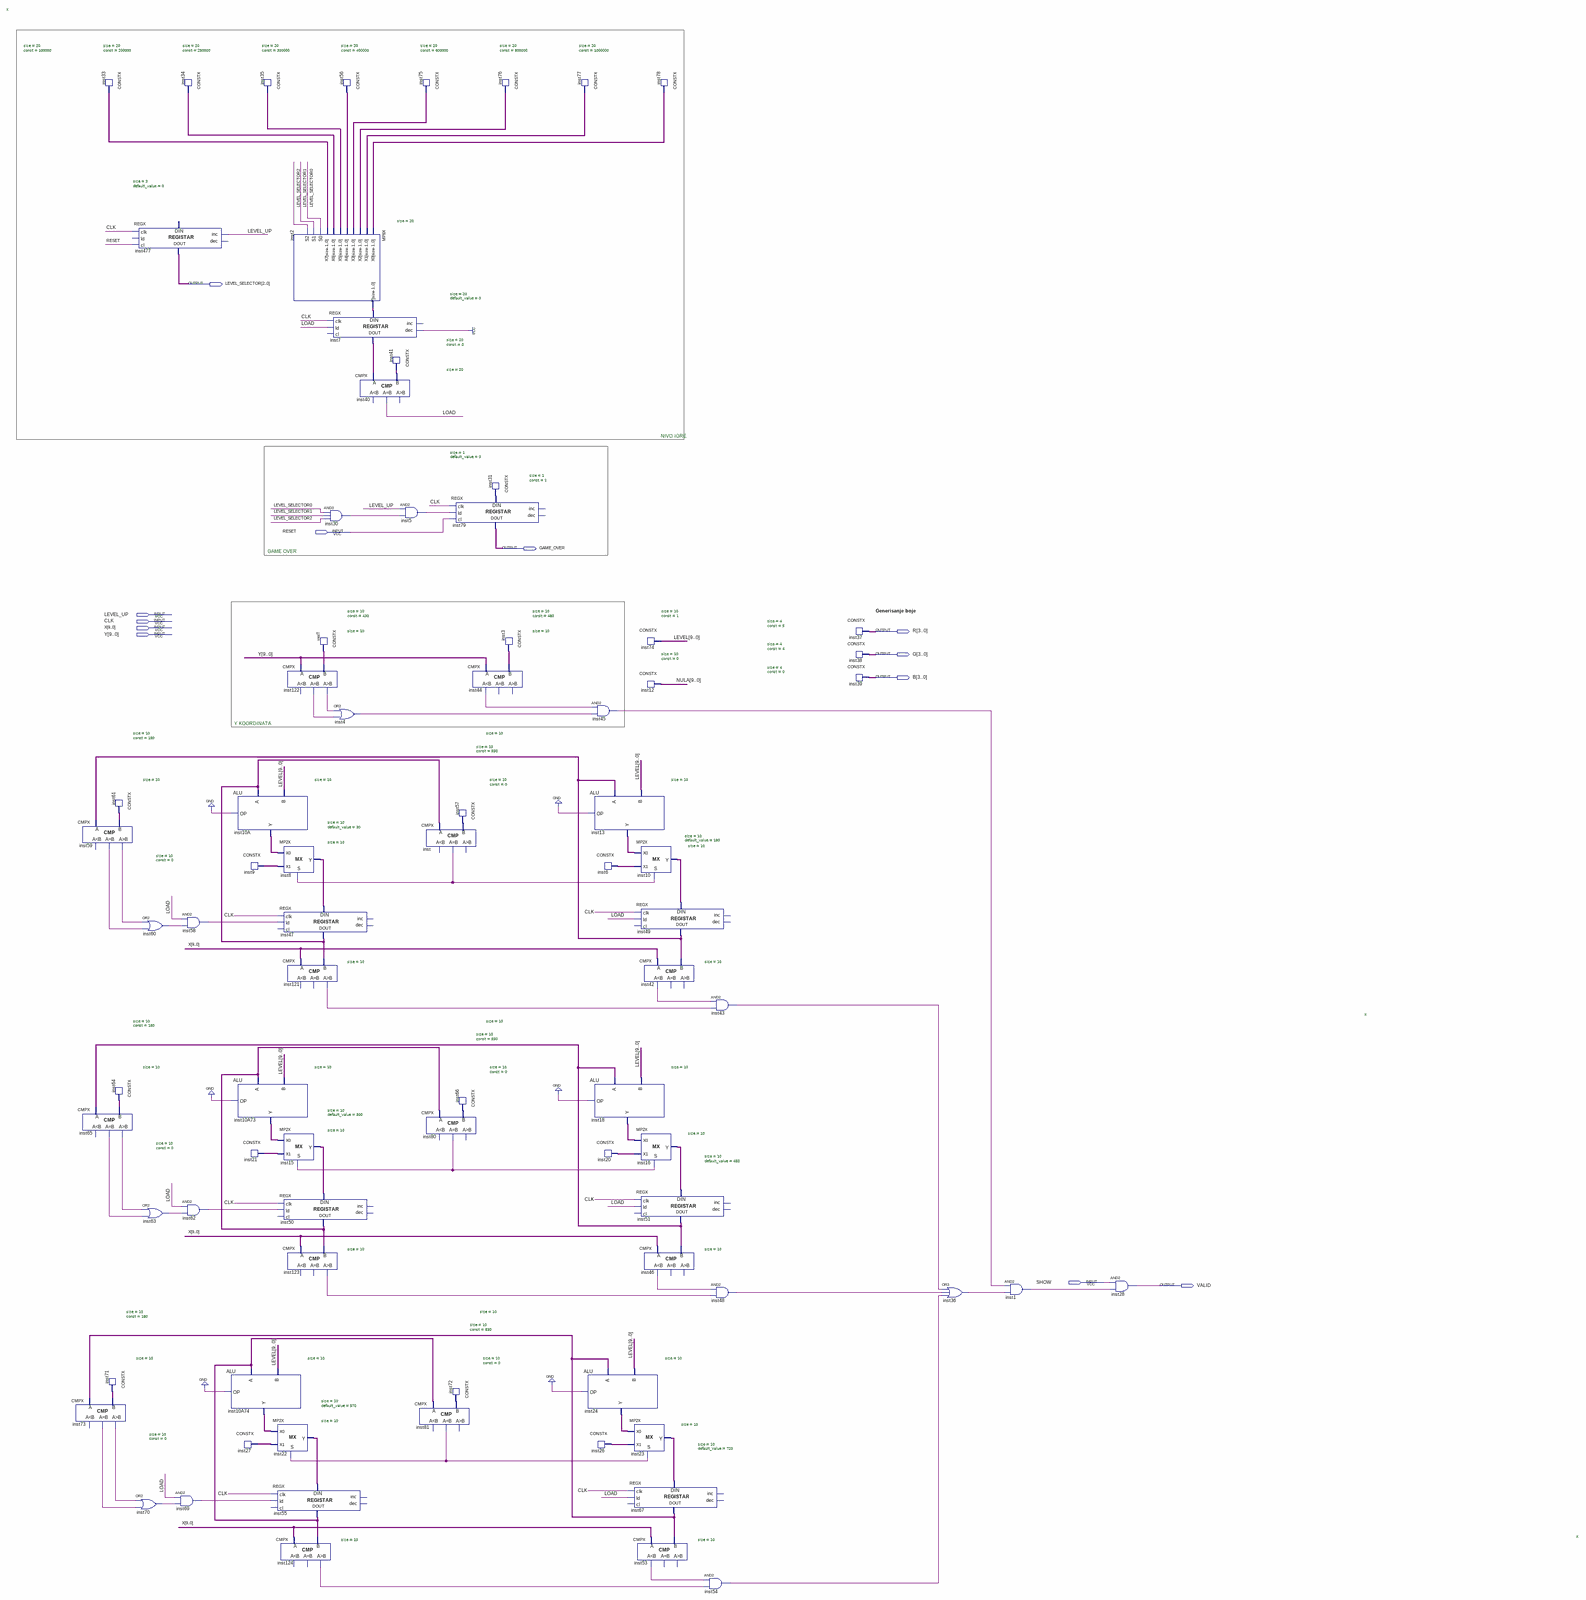
[diagram p0: schematic sheet, whole]
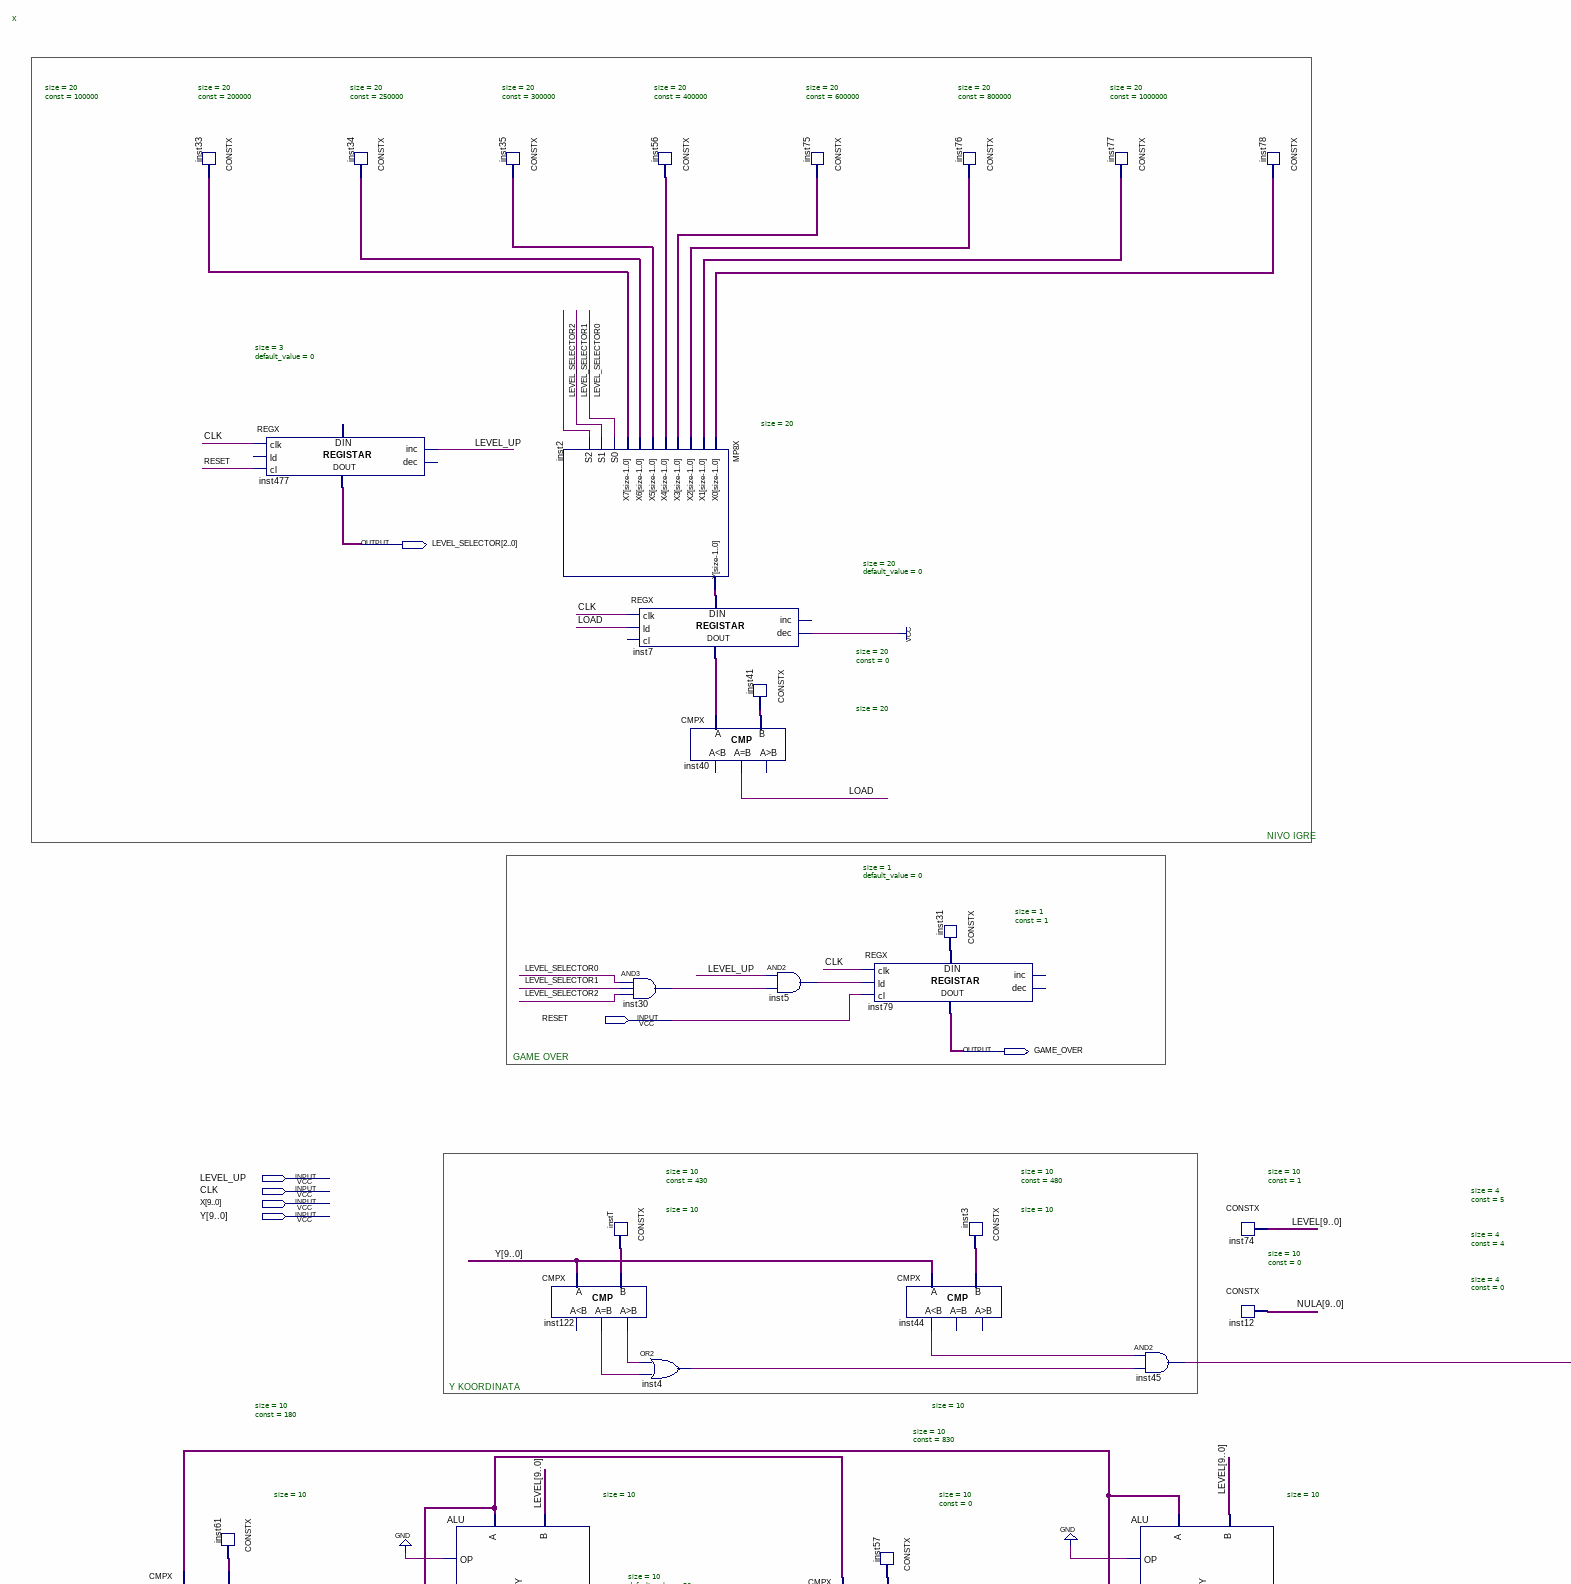
[diagram p1: schematic sheet, upper left part]
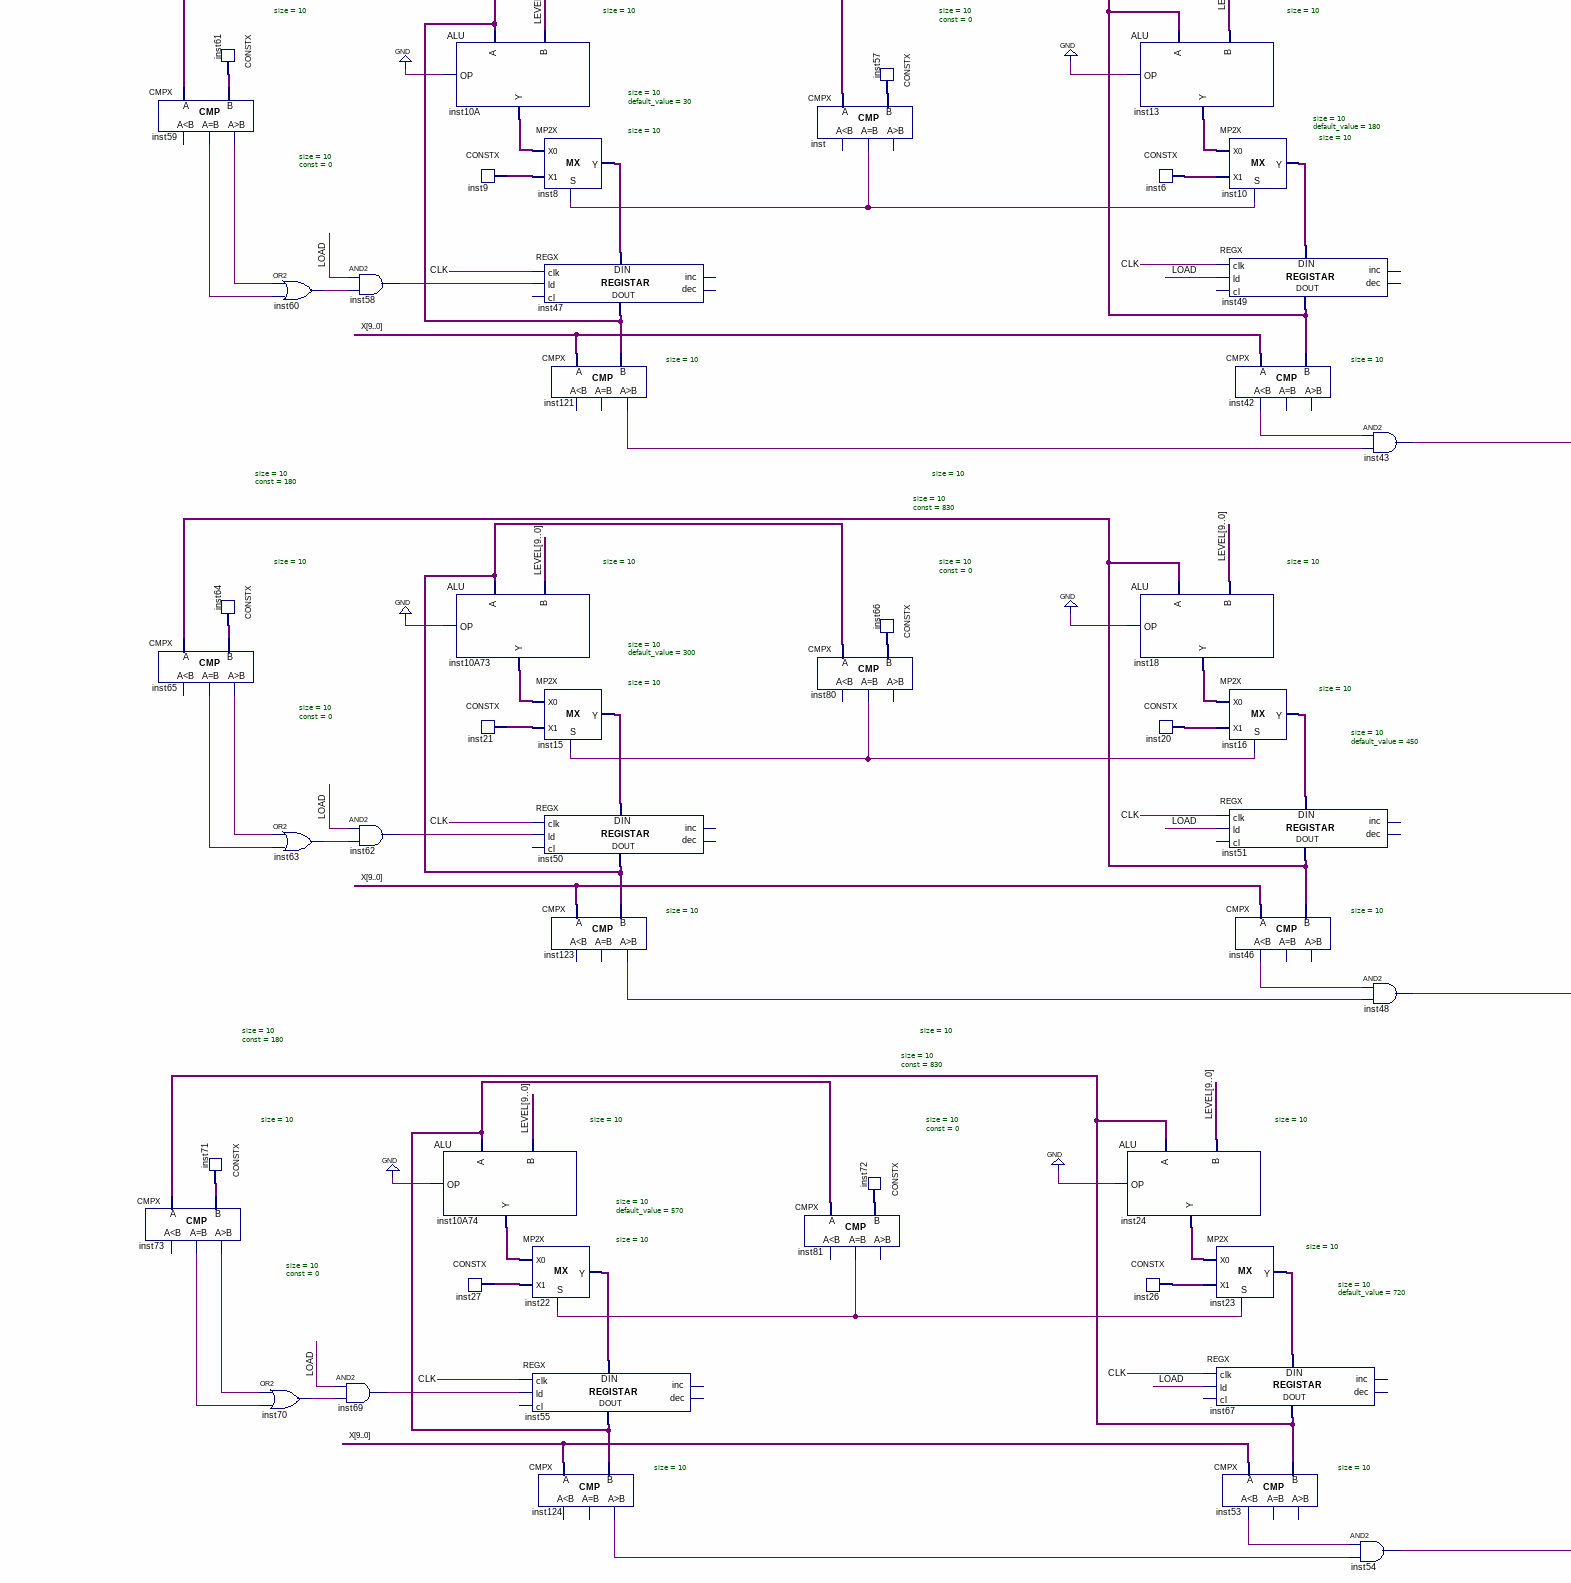
[diagram p2: schematic sheet, lower left part]
// Quartus schematic Layer_Road_3.bdf as structural Verilog: 82 symbols, 12 pins
module Layer_Road_3 (
  input  RESET,
  input  LEVEL_UP,
  input  CLK,
  input  [9:0] X,
  input  [9:0] Y,
  input  SHOW,
  output [2:0] LEVEL_SELECTOR,
  output GAME_OVER,
  output [3:0] R,
  output [3:0] G,
  output [3:0] B,
  output VALID
);

  wire inst1_out, inst4_out, inst5_out, inst30_out, inst31_data, inst36_out, inst42_ls, inst43_out,
       inst44_ls, inst45_out, inst46_ls, inst48_out, inst53_ls, inst54_out, inst58_out, inst59_eq, inst59_gr,
       inst60_out, inst62_out, inst63_out, inst65_eq, inst65_gr, inst69_out, inst70_out, inst73_eq,
       inst73_gr, inst80_eq, inst81_eq, inst121_gr, inst122_eq, inst122_gr, inst123_gr, inst124_gr, inst_eq,
       LOAD;
  wire [9:0] inst3_data, inst6_data, inst8_y, inst9_data, inst10_y, inst10A73_result, inst10A74_result,
       inst10A_result, inst13_result, inst15_y, inst16_y, inst18_result, inst20_data, inst21_data, inst22_y,
       inst23_y, inst24_result, inst26_data, inst27_data, inst47_data_out, inst49_data_out, inst50_data_out,
       inst51_data_out, inst55_data_out, inst57_data, inst61_data, inst64_data, inst66_data, inst67_data_out,
       inst71_data, inst72_data, instT_data, LEVEL, NULA;
  wire [19:0] inst2_y, inst7_data_out, inst33_data, inst34_data, inst35_data, inst41_data, inst56_data,
       inst75_data, inst76_data, inst77_data, inst78_data;

  CMPX #(.size(10)) inst73 (.A(inst67_data_out), .B(inst71_data), .eq(inst73_eq), .gr(inst73_gr));  // open: ls
  CMPX #(.size(10)) inst59 (.A(inst49_data_out), .B(inst61_data), .eq(inst59_eq), .gr(inst59_gr));  // open: ls
  CMPX #(.size(10)) inst65 (.A(inst51_data_out), .B(inst64_data), .eq(inst65_eq), .gr(inst65_gr));  // open: ls
  CONSTX #(.size(20), .\const (100000)) inst33 (.data(inst33_data));
  CONSTX #(.size(10), .\const (180)) inst61 (.data(inst61_data));
  CONSTX #(.size(10), .\const (180)) inst64 (.data(inst64_data));
  CONSTX #(.size(10), .\const (180)) inst71 (.data(inst71_data));
  REGX #(.size(3), .default_value(0)) inst477 (
    .clk(CLK), .cl(RESET), .inc(LEVEL_UP), .data_out(LEVEL_SELECTOR));  // open: ld, dec, data_in
  or inst60 (inst60_out, inst59_gr, inst59_eq);
  or inst63 (inst63_out, inst65_gr, inst65_eq);
  or inst70 (inst70_out, inst73_gr, inst73_eq);
  and inst69 (inst69_out, LOAD, inst70_out);
  CONSTX #(.size(20), .\const (200000)) inst34 (.data(inst34_data));
  and inst58 (inst58_out, LOAD, inst60_out);
  and inst62 (inst62_out, LOAD, inst63_out);
  ALU #(.size(10)) inst10A74 (.op(1'b0), .a(inst55_data_out), .b(LEVEL), .result(inst10A74_result));
  ALU #(.size(10)) inst10A (.op(1'b0), .a(inst47_data_out), .b(LEVEL), .result(inst10A_result));
  CONSTX #(.size(10), .\const (0)) inst9 (.data(inst9_data));
  ALU #(.size(10)) inst10A73 (.op(1'b0), .a(inst50_data_out), .b(LEVEL), .result(inst10A73_result));
  CONSTX #(.size(10), .\const (0)) inst21 (.data(inst21_data));
  CONSTX #(.size(10), .\const (0)) inst27 (.data(inst27_data));
  CONSTX #(.size(20), .\const (250000)) inst35 (.data(inst35_data));
  CMPX #(.size(10)) inst122 (.A(Y), .B(instT_data), .eq(inst122_eq), .gr(inst122_gr));  // open: ls
  MP2X #(.size(10)) inst8 (.S(inst_eq), .X0(inst10A_result), .X1(inst9_data), .Y(inst8_y));
  REGX #(.size(10), .default_value(30)) inst47 (
    .clk(CLK), .ld(inst58_out), .data_in(inst8_y), .data_out(inst47_data_out));  // open: cl, inc, dec
  CMPX #(.size(10)) inst121 (.A(X), .B(inst47_data_out), .gr(inst121_gr));  // open: ls, eq
  MP2X #(.size(10)) inst15 (.S(inst80_eq), .X0(inst10A73_result), .X1(inst21_data), .Y(inst15_y));
  REGX #(.size(10), .default_value(300)) inst50 (
    .clk(CLK), .ld(inst62_out), .data_in(inst15_y), .data_out(inst50_data_out));  // open: cl, inc, dec
  CMPX #(.size(10)) inst123 (.A(X), .B(inst50_data_out), .gr(inst123_gr));  // open: ls, eq
  MP2X #(.size(10)) inst22 (.S(inst81_eq), .X0(inst10A74_result), .X1(inst27_data), .Y(inst22_y));
  REGX #(.size(10), .default_value(570)) inst55 (
    .clk(CLK), .ld(inst69_out), .data_in(inst22_y), .data_out(inst55_data_out));  // open: cl, inc, dec
  CMPX #(.size(10)) inst124 (.A(X), .B(inst55_data_out), .gr(inst124_gr));  // open: ls, eq
  MP8X #(.size(20)) inst2 (
    .X0(inst78_data), .X1(inst77_data), .X2(inst76_data), .X3(inst75_data), .X4(inst56_data),
    .X5(inst35_data), .X6(inst34_data), .X7(inst33_data), .S0(LEVEL_SELECTOR[0]), .S1(LEVEL_SELECTOR[1]),
    .S2(LEVEL_SELECTOR[2]), .Y(inst2_y));
  REGX #(.size(20), .default_value(0)) inst7 (
    .clk(CLK), .ld(LOAD), .dec(1'b1), .data_in(inst2_y), .data_out(inst7_data_out));  // open: cl, inc
  and inst30 (inst30_out, LEVEL_SELECTOR[0], LEVEL_SELECTOR[1], LEVEL_SELECTOR[2]);
  CONSTX #(.size(10), .\const (430)) instT (.data(instT_data));
  or inst4 (inst4_out, inst122_gr, inst122_eq);
  CONSTX #(.size(20), .\const (300000)) inst56 (.data(inst56_data));
  CMPX #(.size(20)) inst40 (.A(inst7_data_out), .B(inst41_data), .eq(LOAD));  // open: ls, gr
  CONSTX #(.size(20), .\const (0)) inst41 (.data(inst41_data));
  and inst5 (inst5_out, LEVEL_UP, inst30_out);
  CMPX #(.size(10)) inst81 (.A(inst55_data_out), .B(inst72_data), .eq(inst81_eq));  // open: ls, gr
  CONSTX #(.size(20), .\const (400000)) inst75 (.data(inst75_data));
  CMPX #(.size(10)) inst (.A(inst47_data_out), .B(inst57_data), .eq(inst_eq));  // open: ls, gr
  CMPX #(.size(10)) inst80 (.A(inst50_data_out), .B(inst66_data), .eq(inst80_eq));  // open: ls, gr
  REGX #(.size(1), .default_value(0)) inst79 (
    .clk(CLK), .ld(inst5_out), .cl(RESET), .data_in(inst31_data), .data_out(GAME_OVER));  // open: inc, dec
  CMPX #(.size(10)) inst44 (.A(Y), .B(inst3_data), .ls(inst44_ls));  // open: eq, gr
  CONSTX #(.size(10), .\const (830)) inst57 (.data(inst57_data));
  CONSTX #(.size(10), .\const (830)) inst66 (.data(inst66_data));
  CONSTX #(.size(10), .\const (830)) inst72 (.data(inst72_data));
  CONSTX #(.size(1), .\const (1)) inst31 (.data(inst31_data));
  CONSTX #(.size(20), .\const (600000)) inst76 (.data(inst76_data));
  CONSTX #(.size(10), .\const (480)) inst3 (.data(inst3_data));
  CONSTX #(.size(20), .\const (800000)) inst77 (.data(inst77_data));
  and inst45 (inst45_out, inst44_ls, inst4_out);
  ALU #(.size(10)) inst13 (.op(1'b0), .a(inst49_data_out), .b(LEVEL), .result(inst13_result));
  CONSTX #(.size(10), .\const (0)) inst6 (.data(inst6_data));
  ALU #(.size(10)) inst18 (.op(1'b0), .a(inst51_data_out), .b(LEVEL), .result(inst18_result));
  CONSTX #(.size(10), .\const (0)) inst20 (.data(inst20_data));
  ALU #(.size(10)) inst24 (.op(1'b0), .a(inst67_data_out), .b(LEVEL), .result(inst24_result));
  CONSTX #(.size(10), .\const (0)) inst26 (.data(inst26_data));
  CONSTX #(.size(10), .\const (1)) inst74 (.data(LEVEL));
  CONSTX #(.size(10), .\const (0)) inst12 (.data(NULA));
  MP2X #(.size(10)) inst10 (.S(inst_eq), .X0(inst13_result), .X1(inst6_data), .Y(inst10_y));
  REGX #(.size(10), .default_value(180)) inst49 (
    .clk(CLK), .ld(LOAD), .data_in(inst10_y), .data_out(inst49_data_out));  // open: cl, inc, dec
  CMPX #(.size(10)) inst42 (.A(X), .B(inst49_data_out), .ls(inst42_ls));  // open: eq, gr
  MP2X #(.size(10)) inst16 (.S(inst80_eq), .X0(inst18_result), .X1(inst20_data), .Y(inst16_y));
  REGX #(.size(10), .default_value(450)) inst51 (
    .clk(CLK), .ld(LOAD), .data_in(inst16_y), .data_out(inst51_data_out));  // open: cl, inc, dec
  CMPX #(.size(10)) inst46 (.A(X), .B(inst51_data_out), .ls(inst46_ls));  // open: eq, gr
  MP2X #(.size(10)) inst23 (.S(inst81_eq), .X0(inst24_result), .X1(inst26_data), .Y(inst23_y));
  REGX #(.size(10), .default_value(720)) inst67 (
    .clk(CLK), .ld(LOAD), .data_in(inst23_y), .data_out(inst67_data_out));  // open: cl, inc, dec
  CMPX #(.size(10)) inst53 (.A(X), .B(inst67_data_out), .ls(inst53_ls));  // open: eq, gr
  CONSTX #(.size(20), .\const (1000000)) inst78 (.data(inst78_data));
  and inst54 (inst54_out, inst53_ls, inst124_gr);
  and inst43 (inst43_out, inst42_ls, inst121_gr);
  and inst48 (inst48_out, inst46_ls, inst123_gr);
  CONSTX #(.size(4), .\const (5)) inst37 (.data(R));
  CONSTX #(.size(4), .\const (4)) inst38 (.data(G));
  CONSTX #(.size(4), .\const (0)) inst39 (.data(B));
  or inst36 (inst36_out, inst43_out, inst48_out, inst54_out);
  and inst1 (inst1_out, inst45_out, inst36_out);
  and inst28 (VALID, SHOW, inst1_out);

  // Notes on the sheet:
  //   x
  //   NIVO IGRE
  //   GAME OVER
  //   Generisanje boje
  //   Y KOORDINATA
  //   x
  //   x
endmodule
